# EAGLE design ubus_rev_b (EAGLE 6.4)
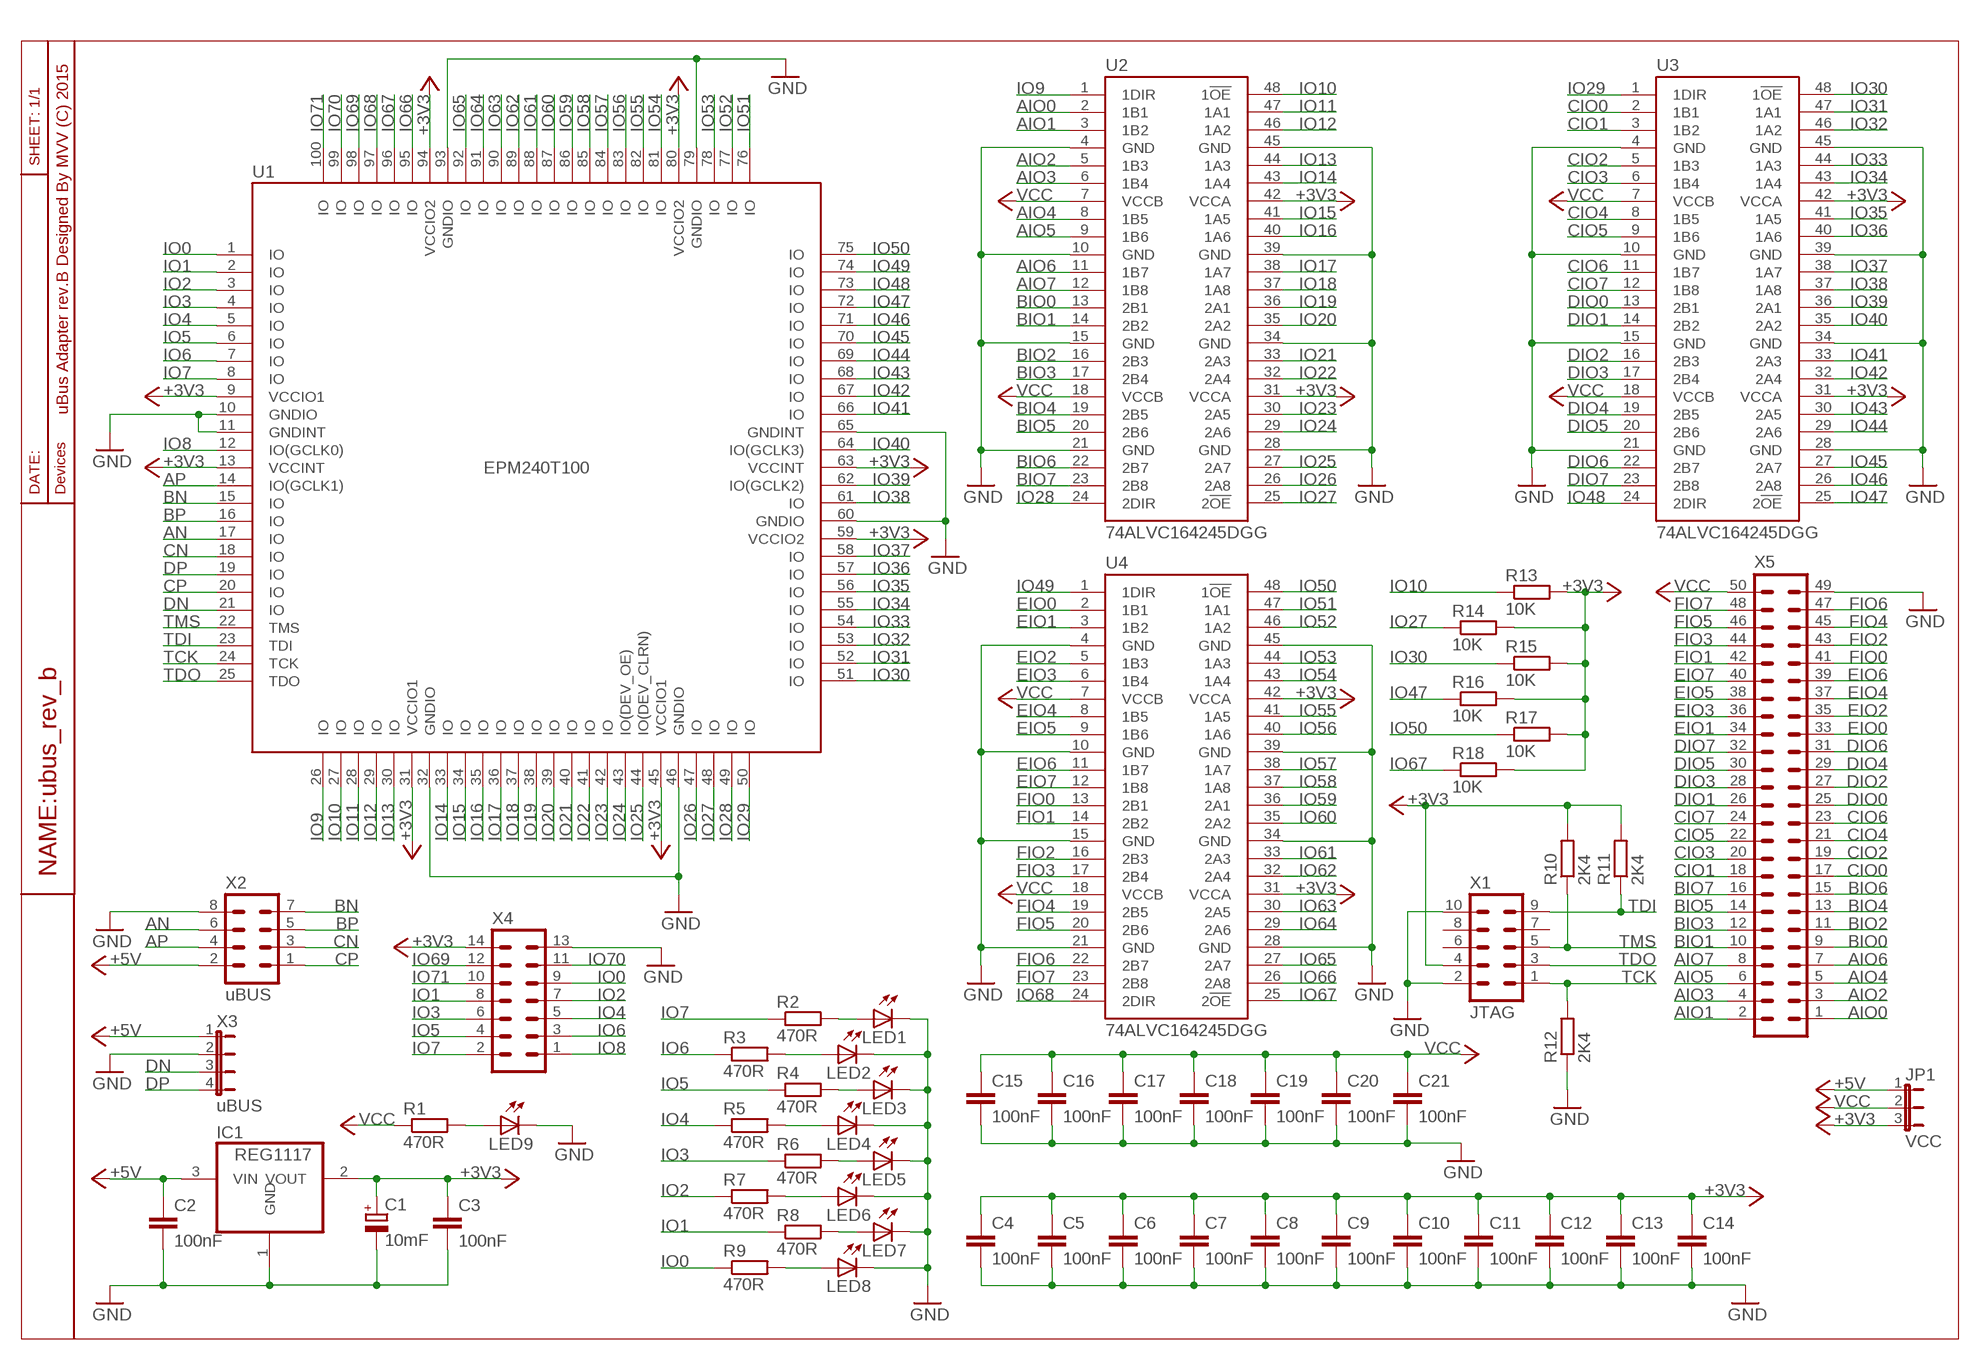
[diagram p0: schematic, sheet 1]

## Parts
C1  10mF  CPOL-EUCT6032  [CT6032]
C2  100nF  C-EUC0805  [C0805]
C3  100nF  C-EUC0805  [C0805]
C4  100nF  C-EUC0805  [C0805]
C5  100nF  C-EUC0805  [C0805]
C6  100nF  C-EUC0805  [C0805]
C7  100nF  C-EUC0805  [C0805]
C8  100nF  C-EUC0805  [C0805]
C9  100nF  C-EUC0805  [C0805]
C10  100nF  C-EUC0805  [C0805]
C11  100nF  C-EUC0805  [C0805]
C12  100nF  C-EUC0805  [C0805]
C13  100nF  C-EUC0805  [C0805]
C14  100nF  C-EUC0805  [C0805]
C15  100nF  C-EUC0805  [C0805]
C16  100nF  C-EUC0805  [C0805]
C17  100nF  C-EUC0805  [C0805]
C18  100nF  C-EUC0805  [C0805]
C19  100nF  C-EUC0805  [C0805]
C20  100nF  C-EUC0805  [C0805]
C21  100nF  C-EUC0805  [C0805]
IC1  REG1117  [SOT223]
JP1  VCC  JP2E  [JP2]
LED1  LEDCHIPLED_0805  [CHIPLED_0805]
LED2  LEDCHIPLED_0805  [CHIPLED_0805]
LED3  LEDCHIPLED_0805  [CHIPLED_0805]
LED4  LEDCHIPLED_0805  [CHIPLED_0805]
LED5  LEDCHIPLED_0805  [CHIPLED_0805]
LED6  LEDCHIPLED_0805  [CHIPLED_0805]
LED7  LEDCHIPLED_0805  [CHIPLED_0805]
LED8  LEDCHIPLED_0805  [CHIPLED_0805]
LED9  LEDCHIPLED_0805  [CHIPLED_0805]
R1  470R  R-EU_R0805  [R0805]
R2  470R  R-EU_R0805  [R0805]
R3  470R  R-EU_R0805  [R0805]
R4  470R  R-EU_R0805  [R0805]
R5  470R  R-EU_R0805  [R0805]
R6  470R  R-EU_R0805  [R0805]
R7  470R  R-EU_R0805  [R0805]
R8  470R  R-EU_R0805  [R0805]
R9  470R  R-EU_R0805  [R0805]
R10  2K4  R-EU_R0805  [R0805]
R11  2K4  R-EU_R0805  [R0805]
R12  2K4  R-EU_R0805  [R0805]
R13  10K  R-EU_R0805  [R0805]
R14  10K  R-EU_R0805  [R0805]
R15  10K  R-EU_R0805  [R0805]
R16  10K  R-EU_R0805  [R0805]
R17  10K  R-EU_R0805  [R0805]
R18  10K  R-EU_R0805  [R0805]
U1  EPM240T100  [TQFP100]
U2  74ALVC164245DGG  [TSSOP48DGG]
U3  74ALVC164245DGG  [TSSOP48DGG]
U4  74ALVC164245DGG  [TSSOP48DGG]
X1  JTAG  ML10  [ML10]
X2  uBUS  MA04-2  [MA04-2]
X3  uBUS  JP4E  [JP4]
X4  ML14  [ML14]
X5  ML50  [ML50]

## Nets
+3V3: C1.+ C3.1 C4.1 C5.1 C6.1 C7.1 C8.1 C9.1 C10.1 C11.1 C12.1 C13.1 C14.1 IC1.2(VOUT) JP1.3 R10.2 R11.2 R13.2 R14.2 R15.2 R16.2 R17.2 R18.2 U1.9(VCCIO1) U1.13(VCCINT) U1.31(VCCIO1) U1.45(VCCIO1) U1.59(VCCIO2) U1.63(VCCINT) U1.80(VCCIO2) U1.94(VCCIO2) U2.31(VCCA) U2.42(VCCA) U3.31(VCCA) U3.42(VCCA) U4.31(VCCA) U4.42(VCCA) X1.4 X4.14
+5V: C2.1 IC1.3(VIN) JP1.1 X2.2 X3.1
AIO0: U2.2(1B1) X5.1
AIO1: U2.3(1B2) X5.2
AIO2: U2.5(1B3) X5.3
AIO3: U2.6(1B4) X5.4
AIO4: U2.8(1B5) X5.5
AIO5: U2.9(1B6) X5.6
AIO6: U2.11(1B7) X5.7
AIO7: U2.12(1B8) X5.8
AN: U1.17(IO) X2.6
AP: U1.14(IO(GCLK1)) X2.4
BIO0: U2.13(2B1) X5.9
BIO1: U2.14(2B2) X5.10
BIO2: U2.16(2B3) X5.11
BIO3: U2.17(2B4) X5.12
BIO4: U2.19(2B5) X5.13
BIO5: U2.20(2B6) X5.14
BIO6: U2.22(2B7) X5.15
BIO7: U2.23(2B8) X5.16
BN: U1.15(IO) X2.7
BP: U1.16(IO) X2.5
CIO0: U3.2(1B1) X5.17
CIO1: U3.3(1B2) X5.18
CIO2: U3.5(1B3) X5.19
CIO3: U3.6(1B4) X5.20
CIO4: U3.8(1B5) X5.21
CIO5: U3.9(1B6) X5.22
CIO6: U3.11(1B7) X5.23
CIO7: U3.12(1B8) X5.24
CN: U1.18(IO) X2.3
CP: U1.20(IO) X2.1
DIO0: U3.13(2B1) X5.25
DIO1: U3.14(2B2) X5.26
DIO2: U3.16(2B3) X5.27
DIO3: U3.17(2B4) X5.28
DIO4: U3.19(2B5) X5.29
DIO5: U3.20(2B6) X5.30
DIO6: U3.22(2B7) X5.31
DIO7: U3.23(2B8) X5.32
DN: U1.21(IO) X3.3
DP: U1.19(IO) X3.4
EIO0: U4.2(1B1) X5.33
EIO1: U4.3(1B2) X5.34
EIO2: U4.5(1B3) X5.35
EIO3: U4.6(1B4) X5.36
EIO4: U4.8(1B5) X5.37
EIO5: U4.9(1B6) X5.38
EIO6: U4.11(1B7) X5.39
EIO7: U4.12(1B8) X5.40
FIO0: U4.13(2B1) X5.41
FIO1: U4.14(2B2) X5.42
FIO2: U4.16(2B3) X5.43
FIO3: U4.17(2B4) X5.44
FIO4: U4.19(2B5) X5.45
FIO5: U4.20(2B6) X5.46
FIO6: U4.22(2B7) X5.47
FIO7: U4.23(2B8) X5.48
GND: C1.- C2.2 C3.2 C4.2 C5.2 C6.2 C7.2 C8.2 C9.2 C10.2 C11.2 C12.2 C13.2 C14.2 C15.2 C16.2 C17.2 C18.2 C19.2 C20.2 C21.2 IC1.1(GND) LED1.C LED2.C LED3.C LED4.C LED5.C LED6.C LED7.C LED8.C LED9.C R12.1 U1.10(GNDIO) U1.11(GNDINT) U1.32(GNDIO) U1.46(GNDIO) U1.60(GNDIO) U1.65(GNDINT) U1.79(GNDIO) U1.93(GNDIO) U2.4(GND) U2.10(GND) U2.15(GND) U2.21(GND) U2.28(GND) U2.34(GND) U2.39(GND) U2.45(GND) U3.4(GND) U3.10(GND) U3.15(GND) U3.21(GND) U3.28(GND) U3.34(GND) U3.39(GND) U3.45(GND) U4.4(GND) U4.10(GND) U4.15(GND) U4.21(GND) U4.28(GND) U4.34(GND) U4.39(GND) U4.45(GND) X1.2 X1.10 X2.8 X3.2 X4.13 X5.49
IO0: R9.1 U1.1(IO) X4.9
IO1: R8.1 U1.2(IO) X4.8
IO2: R7.1 U1.3(IO) X4.7
IO3: R6.1 U1.4(IO) X4.6
IO4: R5.1 U1.5(IO) X4.5
IO5: R4.1 U1.6(IO) X4.4
IO6: R3.1 U1.7(IO) X4.3
IO7: R2.1 U1.8(IO) X4.2
IO8: U1.12(IO(GCLK0)) X4.1
IO9: U1.26(IO) U2.1(1DIR)
IO10: R13.1 U1.27(IO) U2.48(1!OE)
IO11: U1.28(IO) U2.47(1A1)
IO12: U1.29(IO) U2.46(1A2)
IO13: U1.30(IO) U2.44(1A3)
IO14: U1.33(IO) U2.43(1A4)
IO15: U1.34(IO) U2.41(1A5)
IO16: U1.35(IO) U2.40(1A6)
IO17: U1.36(IO) U2.38(1A7)
IO18: U1.37(IO) U2.37(1A8)
IO19: U1.38(IO) U2.36(2A1)
IO20: U1.39(IO) U2.35(2A2)
IO21: U1.40(IO) U2.33(2A3)
IO22: U1.41(IO) U2.32(2A4)
IO23: U1.42(IO) U2.30(2A5)
IO24: U1.43(IO(DEV_OE)) U2.29(2A6)
IO25: U1.44(IO(DEV_CLRN)) U2.27(2A7)
IO26: U1.47(IO) U2.26(2A8)
IO27: R14.1 U1.48(IO) U2.25(2!OE)
IO28: U1.49(IO) U2.24(2DIR)
IO29: U1.50(IO) U3.1(1DIR)
IO30: R15.1 U1.51(IO) U3.48(1!OE)
IO31: U1.52(IO) U3.47(1A1)
IO32: U1.53(IO) U3.46(1A2)
IO33: U1.54(IO) U3.44(1A3)
IO34: U1.55(IO) U3.43(1A4)
IO35: U1.56(IO) U3.41(1A5)
IO36: U1.57(IO) U3.40(1A6)
IO37: U1.58(IO) U3.38(1A7)
IO38: U1.61(IO) U3.37(1A8)
IO39: U1.62(IO(GCLK2)) U3.36(2A1)
IO40: U1.64(IO(GCLK3)) U3.35(2A2)
IO41: U1.66(IO) U3.33(2A3)
IO42: U1.67(IO) U3.32(2A4)
IO43: U1.68(IO) U3.30(2A5)
IO44: U1.69(IO) U3.29(2A6)
IO45: U1.70(IO) U3.27(2A7)
IO46: U1.71(IO) U3.26(2A8)
IO47: R16.1 U1.72(IO) U3.25(2!OE)
IO48: U1.73(IO) U3.24(2DIR)
IO49: U1.74(IO) U4.1(1DIR)
IO50: R17.1 U1.75(IO) U4.48(1!OE)
IO51: U1.76(IO) U4.47(1A1)
IO52: U1.77(IO) U4.46(1A2)
IO53: U1.78(IO) U4.44(1A3)
IO54: U1.81(IO) U4.43(1A4)
IO55: U1.82(IO) U4.41(1A5)
IO56: U1.83(IO) U4.40(1A6)
IO57: U1.84(IO) U4.38(1A7)
IO58: U1.85(IO) U4.37(1A8)
IO59: U1.86(IO) U4.36(2A1)
IO60: U1.87(IO) U4.35(2A2)
IO61: U1.88(IO) U4.33(2A3)
IO62: U1.89(IO) U4.32(2A4)
IO63: U1.90(IO) U4.30(2A5)
IO64: U1.91(IO) U4.29(2A6)
IO65: U1.92(IO) U4.27(2A7)
IO66: U1.95(IO) U4.26(2A8)
IO67: R18.1 U1.96(IO) U4.25(2!OE)
IO68: U1.97(IO) U4.24(2DIR)
IO69: U1.98(IO) X4.12
IO70: U1.99(IO) X4.11
IO71: U1.100(IO) X4.10
N$1: LED1.A R2.2
N$2: LED2.A R3.2
N$3: LED3.A R4.2
N$4: LED4.A R5.2
N$5: LED5.A R6.2
N$6: LED6.A R7.2
N$7: LED7.A R8.2
N$8: LED8.A R9.2
N$12: LED9.A R1.2
TCK: R12.2 U1.24(TCK) X1.1
TDI: R11.1 U1.23(TDI) X1.9
TDO: U1.25(TDO) X1.3
TMS: R10.1 U1.22(TMS) X1.5
VCC: C15.1 C16.1 C17.1 C18.1 C19.1 C20.1 C21.1 JP1.2 R1.1 U2.7(VCCB) U2.18(VCCB) U3.7(VCCB) U3.18(VCCB) U4.7(VCCB) U4.18(VCCB) X5.50
Unconnected: X1.6 X1.7 X1.8

## Notes on the sheet
- uBus Adapter rev.B Designed By MVV (C) 2015

## Library data of the parts
C1 = rcl:CPOL-EU: POLARIZED CAPACITOR, European symbol
C2-C21 = rcl:C-EU: CAPACITOR, European symbol
IC1 = burr-brown:REG1117: 800mA and 1A Low Dropout (LDO) Positive Regulator 1.8V, 2.5V, 2.85V, 3.3V, 5V, and Adj; MPN: REG1117; OC_FARNELL: 1097566; OC_NEWARK: 14P6981
JP1 = jumper:JP2E: JUMPER
LED1-LED9 = led:LED: LED OSRAM: - CHIPLED LG R971, LG N971, LY N971, LG Q971, LY Q971, LO R971, LY R971 LH N974, LH R974 LS Q976, LO Q976, LY Q976 LO Q996 - Hyper CHIPLED LW Q18S LB Q993, LB Q99A, LB R99A - SideLED LS A670, LO A670, LY A670, LG A670, LP A670 LB A673, LV A673, LT A673, LW A673 LH A674 LY A675 LS A676, LA A676, LO A676, LY A676, LW A676 LS A679, LY A679, LG A679 - Hyper Micro SIDELED® LS Y876, LA Y876, LO Y876, LY Y876 LT Y87S - SmartLED LW L88C, LW L88S LB L89C, LB L89S, LG L890 LS L89K, LO L89K, LY L89K LS L896, LA L896, LO L896, LY L896 - TOPLED LS T670, LO T670, LY T670, LG T670, LP T670 LSG T670, LSP T670, LSY T670, LOP T670, LYG T670 LG T671, LOG T671, LSG T671 LB T673, LV T673, LT T673, LW T673 LH T674 LS T676, LA T676, LO T676, LY T676, LB T676, LH T676, LSB T676, LW T676 LB T67C, LV T67C, LT T67C, LS T67K, LO T67K, LY T67K, LW E67C LS E67B, LA E67B, LO E67B, LY E67B, LB E67C, LV E67C, LT E67C LW T67C LS T679, LY T679, LG T679 LS T770, LO T770, LY T770, LG T770, LP T770 LB T773, LV T773, LT T773, LW T773 LH T774 LS E675, LA E675, LY E675, LS T675 LS T776, LA T776, LO T776, LY T776, LB T776 LHGB T686 LT T68C, LB T68C - Hyper Mini TOPLED® LB M676 - Mini TOPLED Santana® LG M470 LS M47K, LO M47K, LY M47K Source: http://www.osram.convergy.de LUXEON: - LUMILED® LXK2-PW12-R00, LXK2-PW12-S00, LXK2-PW14-U00, LXK2-PW14-V00 LXK2-PM12-R00, LXK2-PM12-S00, LXK2-PM14-U00 LXK2-PE12-Q00, LXK2-PE12-R00, LXK2-PE12-S00, LXK2-PE14-T00, LXK2-PE14-U00 LXK2-PB12-K00, LXK2-PB12-L00, LXK2-PB12-M00, LXK2-PB14-N00, LXK2-PB14-P00, LXK2-PB14-Q00 LXK2-PR12-L00, LXK2-PR12-M00, LXK2-PR14-Q00, LXK2-PR14-R00 LXK2-PD12-Q00, LXK2-PD12-R00, LXK2-PD12-S00 LXK2-PH12-R00, LXK2-PH12-S00 LXK2-PL12-P00, LXK2-PL12-Q00, LXK2-PL12-R00 Source: www.luxeon.com KINGBRIGHT: KA-3528ASYC Source: www.kingbright.com
R1-R18 = rcl:R-EU_: RESISTOR, European symbol
U1 = altera:EPM240T100
U2-U4 = _74ac-logic:74ALVC164245
X1 = con-ml:ML10: HARTING
X2 = con-lstb:MA04-2: PIN HEADER; OC_FARNELL: unknown; OC_NEWARK: unknown
X3 = jumper:JP4E: JUMPER
X4 = con-ml:ML14: HARTING
X5 = con-ml:ML50: HARTING

## Board
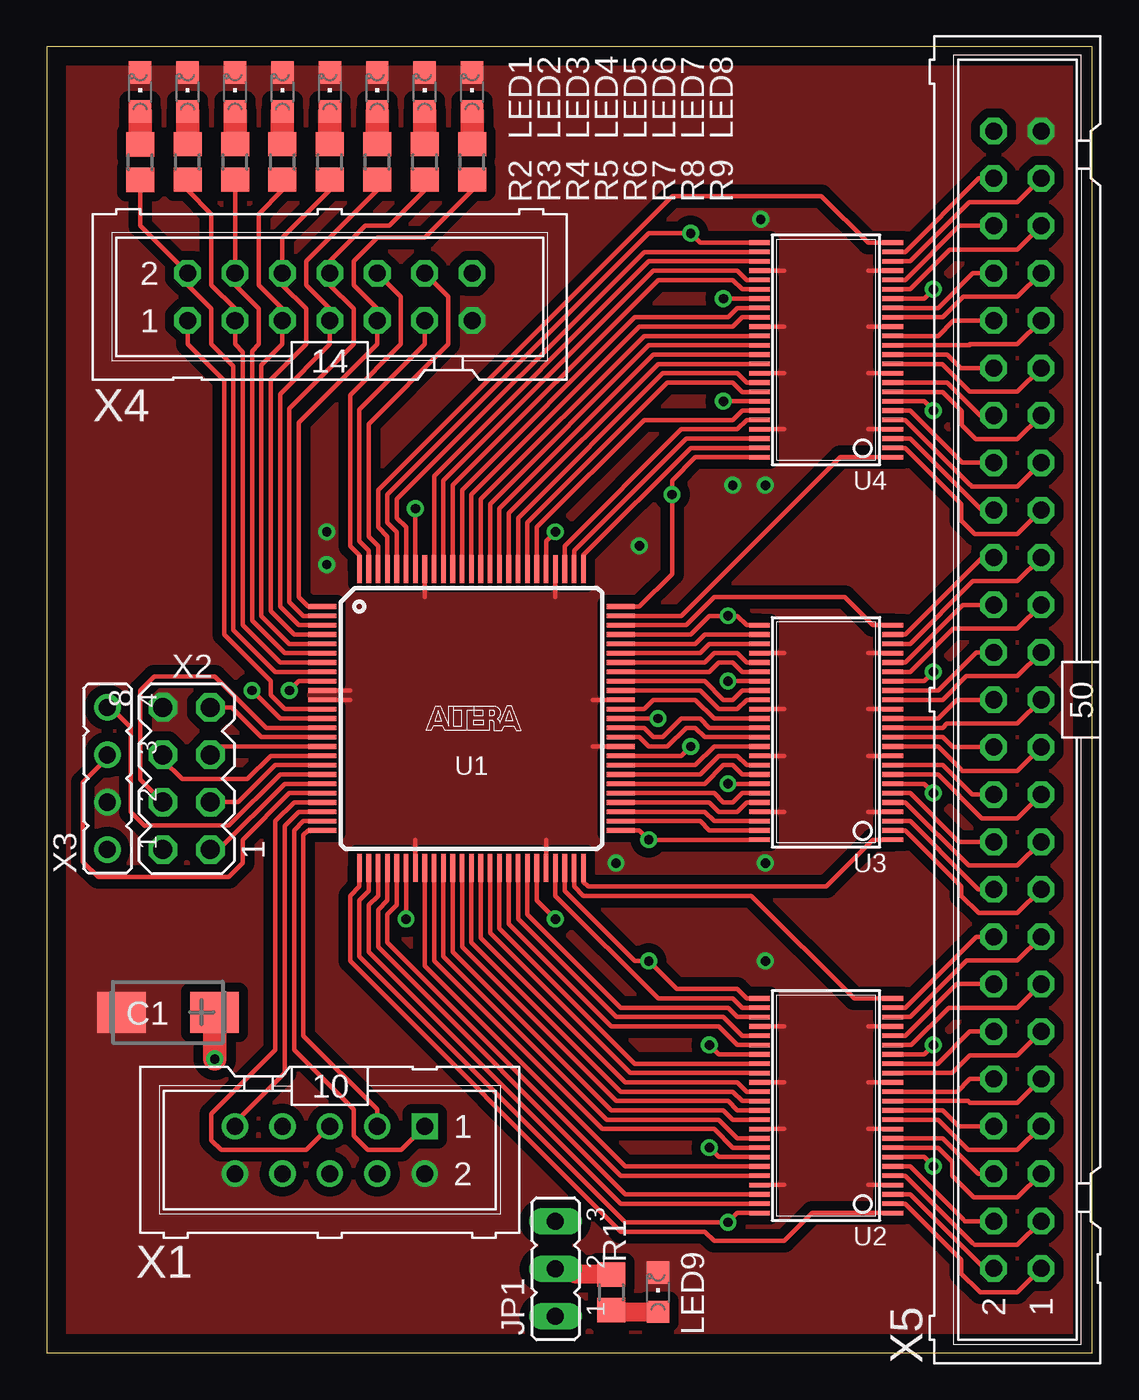
[diagram p1: board, top side]
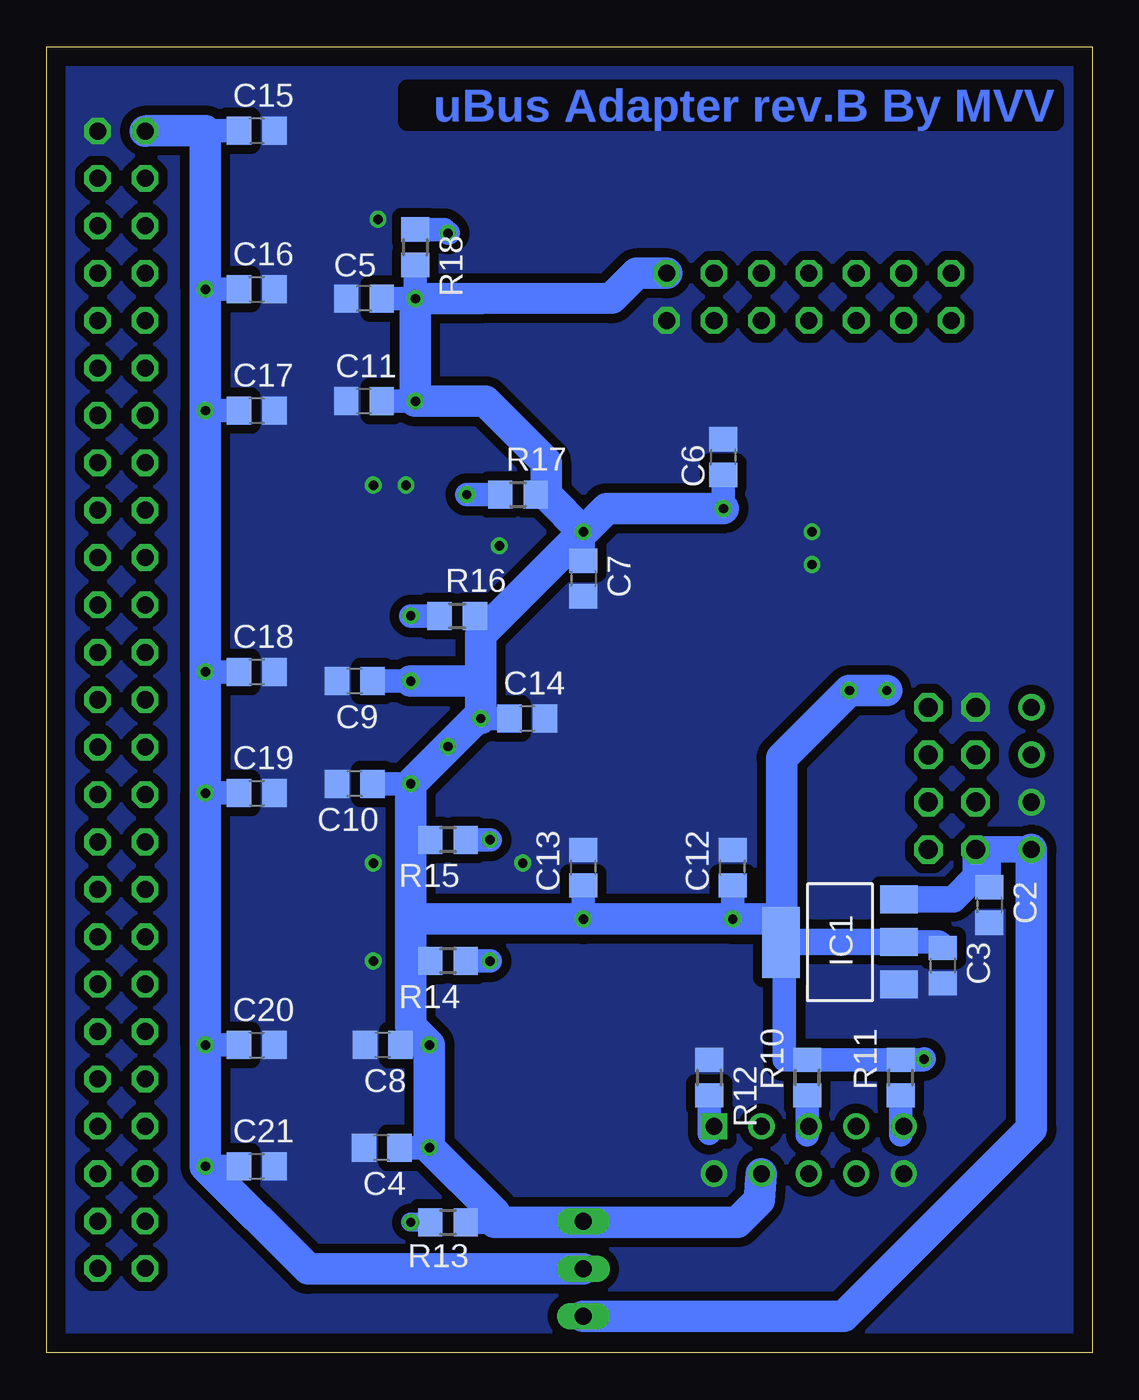
[diagram p2: board, bottom side, seen from below]

Size 56 x 70 mm. Coordinates in mm from the lower left corner, seen from the top.
Outline: 0,0 56,0 56,70 0,70 0,0
Copper layers (1*16): Top 0.035mm / dielectric 1.5mm / Bottom 0.035mm
Design rules "default": minimum track width 10mil, minimum drill 24mil, track to track 8mil, track to pad 8mil, pad to pad 8mil, via to via 8mil, smd to smd 8mil, copper to edge 40mil, drill to drill 8mil, minimum pad ring 10mil, minimum via ring 8mil, stop-mask expansion 4mil, vias tented up to drill 0mil, thermal gap 10mil

### Footprints (pad centres in the part's own frame; a part is rotated, then mirrored left to right if it is on the bottom)
CT6032 = smd 2.6 x 2.2: + -2.5,0; - 2.5,0
C0805 = smd 1.3 x 1.5: 1 -0.95,0; 2 0.95,0
SOT223 = smd 1.499 x 2.007: 1 -2.261,-3.15; 2 0.025,-3.15; 3 2.311,-3.15 | smd 3.81 x 2.007: 4 0,3.15
JP2 = drill 0.914 long: 1 -2.54,0; 2 0,0; 3 2.54,0
CHIPLED_0805 = smd 1.2 x 1.2: A 0,-1.05; C 0,1.05
R0805 = smd 1.3 x 1.5: 1 -0.95,0; 2 0.95,0
TQFP100 = smd 1.5 x 0.25: 1 -8,6; 2 -8,5.5; 3 -8,5; 4 -8,4.5; 5 -8,4; 6 -8,3.5; 7 -8,3; 8 -8,2.5; 9 -8,2; 10 -8,1.5; 11 -8,1; 12 -8,0.5; 13 -8,0; 14 -8,-0.5; 15 -8,-1; 16 -8,-1.5; 17 -8,-2; 18 -8,-2.5; 19 -8,-3; 20 -8,-3.5; 21 -8,-4; 22 -8,-4.5; 23 -8,-5; 24 -8,-5.5; 25 -8,-6; 51 8,-6; 52 8,-5.5; 53 8,-5; 54 8,-4.5; 55 8,-4; 56 8,-3.5; 57 8,-3; 58 8,-2.5; 59 8,-2; 60 8,-1.5; 61 8,-1; 62 8,-0.5; 63 8,0; 64 8,0.5; 65 8,1; 66 8,1.5; 67 8,2; 68 8,2.5; 69 8,3; 70 8,3.5; 71 8,4; 72 8,4.5; 73 8,5; 74 8,5.5; 75 8,6 | smd 0.25 x 1.5: 26 -6,-8; 27 -5.5,-8; 28 -5,-8; 29 -4.5,-8; 30 -4,-8; 31 -3.5,-8; 32 -3,-8; 33 -2.5,-8; 34 -2,-8; 35 -1.5,-8; 36 -1,-8; 37 -0.5,-8; 38 0,-8; 39 0.5,-8; 40 1,-8; 41 1.5,-8; 42 2,-8; 43 2.5,-8; 44 3,-8; 45 3.5,-8; 46 4,-8; 47 4.5,-8; 48 5,-8; 49 5.5,-8; 50 6,-8; 76 6,8; 77 5.5,8; 78 5,8; 79 4.5,8; 80 4,8; 81 3.5,8; 82 3,8; 83 2.5,8; 84 2,8; 85 1.5,8; 86 1,8; 87 0.5,8; 88 0,8; 89 -0.5,8; 90 -1,8; 91 -1.5,8; 92 -2,8; 93 -2.5,8; 94 -3,8; 95 -3.5,8; 96 -4,8; 97 -4.5,8; 98 -5,8; 99 -5.5,8; 100 -6,8
TSSOP48DGG = smd 0.25 x 1.1: 1 -5.5,-3.575; 2 -5,-3.575; 3 -4.5,-3.575; 4 -4,-3.575; 5 -3.5,-3.575; 6 -3,-3.575; 7 -2.5,-3.575; 8 -2,-3.575; 9 -1.5,-3.575; 10 -1,-3.575; 11 -0.5,-3.575; 12 0,-3.575; 13 0.5,-3.575; 14 1,-3.575; 15 1.5,-3.575; 16 2,-3.575; 17 2.5,-3.575; 18 3,-3.575; 19 3.5,-3.575; 20 4,-3.575; 21 4.5,-3.575; 22 5,-3.575; 23 5.5,-3.575; 24 6,-3.575; 25 6,3.575; 26 5.5,3.575; 27 5,3.575; 28 4.5,3.575; 29 4,3.575; 30 3.5,3.575; 31 3,3.575; 32 2.5,3.575; 33 2,3.575; 34 1.5,3.575; 35 1,3.575; 36 0.5,3.575; 37 0,3.575; 38 -0.5,3.575; 39 -1,3.575; 40 -1.5,3.575; 41 -2,3.575; 42 -2.5,3.575; 43 -3,3.575; 44 -3.5,3.575; 45 -4,3.575; 46 -4.5,3.575; 47 -5,3.575; 48 -5.5,3.575
ML10 = drill 0.9 square: 1 -5.08,-1.27 | drill 0.9: 2 -5.08,1.27; 3 -2.54,-1.27; 4 -2.54,1.27; 5 0,-1.27; 6 0,1.27; 7 2.54,-1.27; 8 2.54,1.27; 9 5.08,-1.27; 10 5.08,1.27
MA04-2 = drill 1.016 octagon: 1 -3.81,-1.27; 2 -3.81,1.27; 3 -1.27,-1.27; 4 -1.27,1.27; 5 1.27,-1.27; 6 1.27,1.27; 7 3.81,-1.27; 8 3.81,1.27
JP4 = drill 0.914: 1 -3.81,0; 2 -1.27,0; 3 1.27,0; 4 3.81,0
ML14 = drill 0.914 octagon: 1 -7.62,-1.27; 2 -7.62,1.27; 3 -5.08,-1.27; 4 -5.08,1.27; 5 -2.54,-1.27; 6 -2.54,1.27; 7 0,-1.27; 8 0,1.27; 9 2.54,-1.27; 10 2.54,1.27; 11 5.08,-1.27; 12 5.08,1.27; 13 7.62,-1.27; 14 7.62,1.27
ML50 = drill 0.914 octagon: 1 -30.48,-1.27; 2 -30.48,1.27; 3 -27.94,-1.27; 4 -27.94,1.27; 5 -25.4,-1.27; 6 -25.4,1.27; 7 -22.86,-1.27; 8 -22.86,1.27; 9 -20.32,-1.27; 10 -20.32,1.27; 11 -17.78,-1.27; 12 -17.78,1.27; 13 -15.24,-1.27; 14 -15.24,1.27; 15 -12.7,-1.27; 16 -12.7,1.27; 17 -10.16,-1.27; 18 -10.16,1.27; 19 -7.62,-1.27; 20 -7.62,1.27; 21 -5.08,-1.27; 22 -5.08,1.27; 23 -2.54,-1.27; 24 -2.54,1.27; 25 0,-1.27; 26 0,1.27; 27 2.54,-1.27; 28 2.54,1.27; 29 5.08,-1.27; 30 5.08,1.27; 31 7.62,-1.27; 32 7.62,1.27; 33 10.16,-1.27; 34 10.16,1.27; 35 12.7,-1.27; 36 12.7,1.27; 37 15.24,-1.27; 38 15.24,1.27; 39 17.78,-1.27; 40 17.78,1.27; 41 20.32,-1.27; 42 20.32,1.27; 43 22.86,-1.27; 44 22.86,1.27; 45 25.4,-1.27; 46 25.4,1.27; 47 27.94,-1.27; 48 27.94,1.27; 49 30.48,-1.27; 50 30.48,1.27

### Placement (x,y rotation side)
C1  6.5,18.25 180 top
C2  5.5,24 270 bottom
C3  8,20.75 270 bottom
C4  38.05,10.99 180 bottom
C5  39,56.5 180 bottom
C6  19.75,48 90 bottom
C7  27.25,41.5 270 bottom
C8  38,16.5 180 bottom
C9  39.5,36 180 bottom
C10  39.5,30.5 180 bottom
C11  39,51 180 bottom
C12  19.25,26 90 bottom
C13  27.25,26 90 bottom
C14  30.25,34 0 bottom
C15  44.75,65.5 0 bottom
C16  44.75,57 0 bottom
C17  44.75,50.5 0 bottom
C18  44.75,36.5 0 bottom
C19  44.75,30 0 bottom
C20  44.75,16.5 0 bottom
C21  44.75,10 0 bottom
IC1  13.5,22 90 bottom
JP1  27.25,4.5 90 top
LED1  5.01,67.57 0 top
LED2  7.55,67.57 0 top
LED3  10.09,67.57 0 top
LED4  12.63,67.57 0 top
LED5  15.17,67.57 0 top
LED6  17.71,67.57 0 top
LED7  20.25,67.57 0 top
LED8  22.79,67.57 0 top
LED9  32.75,3.25 0 top
R1  30.25,3.25 270 top
R2  5.01,63.8 90 top
R3  7.55,63.82 90 top
R4  10.09,63.82 90 top
R5  12.63,63.82 90 top
R6  15.17,63.82 90 top
R7  17.71,63.82 90 top
R8  20.25,63.82 90 top
R9  22.79,63.82 90 top
R10  15.25,14.75 90 bottom
R11  10.25,14.75 90 bottom
R12  20.5,14.75 270 bottom
R13  34.5,7 0 bottom
R14  34.5,21 180 bottom
R15  34.5,27.5 180 bottom
R16  34,39.5 0 bottom
R17  30.75,46 0 bottom
R18  36.25,59.25 270 bottom
U1  22.75,34 0 top
U2  41.75,13 90 top
U3  41.75,33 90 top
U4  41.75,53.5 90 top
X1  15.17,10.87 180 top
X2  7.5,30.78 90 top
X3  3.25,30.78 90 top
X4  15.17,56.59 0 top
X5  52,35 90 top

### Tracks (layer width: path | path; a pad name or v marks a point on that pad's centre or on a via)
+3V3  (via drill 0.5)
  Top 0.25: U4.31 v36.25,56.5 | U1.80 26.75,43.5 v27.25,44 | U1.94 v19.75,45.25 | U3.42 v36.5,30.5 | U1.63 v32.75,34 | U3.31 v36.5,36 | U1.31 v19.25,23.25 | U1.45 26.25,24.25 v27.25,23.25 | U1.59 34,32 v34.5,32.5 | U4.42 v36.25,51 | U1.13 12.5,34 v11,35.5 | U1.9 13.5,36 v13,35.5
  Top 0.254: U2.31 36,16 v35.5,16.5 | U2.42 36,10.5 v35.5,11
  Top 1.27: C1.+ v9,15.75
  Bottom 1.27: C6.1 v19.75,45.25 | C8.1 v35.5,16.5 | C4.1 v35.51,10.99 v35.5,11 | C14.1 v32.75,34 | C10.1 v36.5,30.5 | C12.1 v19.25,23.25 | C13.1 v27.25,23.25 | R13.2 32,7 | R18.2 v36.25,56.5 C5.1 | IC1.2 8.33,22.02 arc90 C3.1 | JP1.3 27.5,7 | R14.2 36.5,21 | R15.2 36.5,27.5 | 16.5,22 16.5,15.7 R10.2 R11.2 9.05,15.7 v9,15.75 | v36.5,36 C9.1 | R16.2 31.75,39.5 | C11.1 v36.25,51 | C7.1 v27.25,44 | R17.2 29.25,46
  Bottom 1.422: IC1.2 16.5,22.02 16.5,22
  Bottom 1.676: X1.4 17.83,8.17 19,7 27.5,7 32,7 32,7.5 v35.5,11 v35.5,16.5 36.5,17.5 36.5,21 36.5,23.25 | 36.5,23.25 36.5,27.5 v36.5,30.5 v34.5,32.5 33,34 v32.75,34 32.75,36.25 | 36.5,23.25 v27.25,23.25 v19.25,23.25 17.12,23.25 16.62,22.75 | 16.5,22 16.62,22.12 16.62,22.75 | 16.62,22.75 16.62,31.88 v13,35.5 v11,35.5 | 32.75,36.25 32.75,38.5 31.75,39.5 v27.25,44 | v36.5,36 33,36 arc-90 32.75,36.25 | v19.75,45.25 26,45.25 v27.25,44 | v27.25,44 29.25,46 29.25,47.75 32.5,51 v36.25,51 v36.25,56.5 32.75,56.5 25.73,56.52 24.39,57.86 X4.14
+5V
  Bottom 1.27: 10.41,24.25 IC1.3 | C2.1 5.5,26.97
  Bottom 1.422: X3.1 5.5,26.97 X2.2 6.23,25.52 7.44,24.31 IC1.3
  Bottom 1.676: JP1.1 13.29,1.96 3.25,12 X3.1
AIO0
  Top 0.25: U2.2 46,8 49,5 49,4.25 49.91,3.34
  Top 0.254: X5.1 52,3.25 50,3.25 49.91,3.34
AIO1
  Top 0.25: U2.3 46.25,8.5 50.14,4.61
  Top 0.254: 50.14,4.61 50.23,4.52 X5.2
AIO2
  Top 0.25: U2.5 46,9.5 49.62,5.88
  Top 0.254: X5.3 52,5.79 49.71,5.79 49.62,5.88
AIO3
  Top 0.25: U2.6 46.25,10 49.1,7.15
  Top 0.254: X5.4 49.19,7.06 49.1,7.15
AIO4
  Top 0.25: U2.8 47.75,11 48.5,10.25 48.5,9.5 49.58,8.42
  Top 0.254: X5.5 52,8.33 49.67,8.33 49.58,8.42
AIO5
  Top 0.25: U2.9 48,11.5
  Top 0.254: X5.6 49.9,9.6 48,11.5
AIO6
  Top 0.25: U2.11 47.75,12.5 49.29,10.96
  Top 0.254: X5.7 52,10.87 49.38,10.87 49.29,10.96
AIO7
  Top 0.25: U2.12 48,13 48.77,12.23
  Top 0.254: X5.8 48.86,12.14 48.77,12.23
AN
  Top 0.25: U1.17 12,32 10.75,30.75 7.26,30.75 6.23,31.78 X2.6
AP
  Top 0.25: U1.14 11.75,33.5 9,36.25 5.75,36.25 5,35.5 5,30.74 X2.4
BIO0
  Top 0.254: X5.9 52,13.41 49.46,13.41 49.37,13.5 U2.13
BIO1
  Top 0.25: U2.14 47.89,14
  Top 0.254: X5.10 49.46,14.68 48.78,14 47.89,14
BIO2
  Top 0.25: U2.16 48.12,15
  Top 0.254: X5.11 52,15.95 49.46,15.95 48.51,15 48.12,15
BIO3
  Top 0.25: U2.17 47.35,15.5
  Top 0.254: X5.12 49.46,17.22 47.74,15.5 47.35,15.5
BIO4
  Top 0.25: U2.19 46.33,16.5
  Top 0.254: X5.13 52,18.49 48.32,18.49 46.33,16.5
BIO5
  Top 0.25: U2.20 46,17
  Top 0.254: X5.14 48.76,19.76 46,17
BIO6
  Top 0.25: U2.22 46.25,18
  Top 0.254: X5.15 52,21.03 49.28,21.03 46.25,18
BIO7
  Top 0.25: U2.23 46,18.5
  Top 0.254: X5.16 49.8,22.3 46,18.5
BN
  Top 0.25: X2.7 9.91,34.59 11.5,33 U1.15
BP
  Top 0.25: X2.5 8.82,32 9,32.25 9.25,32.5 U1.16
CIO0
  Top 0.25: U3.2 46,28 49,25 49,24.5
  Top 0.254: X5.17 52,23.57 49.93,23.57 49,24.5
CIO1
  Top 0.25: U3.3 46.25,28.5
  Top 0.254: X5.18 49.96,24.84 49.91,24.84 49.75,25 49.46,25.29 46.25,28.5
CIO2
  Top 0.25: U3.5 46,29.5
  Top 0.254: X5.19 52,26.11 49.39,26.11 46,29.5
CIO3
  Top 0.25: U3.6 46.25,30 48.78,27.47
  Top 0.254: X5.20 48.87,27.38 48.78,27.47
CIO4
  Top 0.25: U3.8 47.75,31
  Top 0.254: X5.21 52,28.65 50.1,28.65 47.75,31
CIO5
  Top 0.25: U3.9 48,31.5
  Top 0.254: X5.22 49.58,29.92 48,31.5
CIO6
  Top 0.25: U3.11 47.75,32.5 48.97,31.28
  Top 0.254: X5.23 52,31.19 49.06,31.19 48.97,31.28
CIO7
  Top 0.25: U3.12 48,33 48.45,32.55
  Top 0.254: 48.45,32.55 48.54,32.46 X5.24
CN
  Top 0.25: X2.3 10.26,29.51 12.25,31.5 U1.18
CP
  Top 0.25: X2.1 9.22,26.97 12.75,30.5 U1.20
DIO0
  Top 0.25: U3.13 48,33.5
  Top 0.254: X5.25 52,33.73 48.23,33.73 48,33.5
DIO1
  Top 0.25: U3.14 47.75,34
  Top 0.254: X5.26 48.75,35 47.75,34
DIO2
  Top 0.25: U3.16 48,35
  Top 0.254: X5.27 52,36.27 49.27,36.27 48,35
DIO3
  Top 0.25: U3.17 47.75,35.5
  Top 0.254: X5.28 49.79,37.54 47.75,35.5
DIO4
  Top 0.25: U3.19 46.25,36.5
  Top 0.254: X5.29 52,38.81 48.56,38.81 46.25,36.5
DIO5
  Top 0.25: U3.20 46,37
  Top 0.254: X5.30 49.08,40.08 46,37
DIO6
  Top 0.25: U3.22 46.25,38
  Top 0.254: X5.31 52,41.35 49.6,41.35 46.25,38
DIO7
  Top 0.25: U3.23 46,38.5
  Top 0.254: X5.32 50.12,42.62 46,38.5
DN
  Top 0.25: U1.21 13,30 10.5,27.5 10.5,26.25 9.75,25.5 2.75,25.5 1.94,26.31 1.94,30.57 3.25,31.88 X3.3
DP
  Top 0.25: U1.19 12.5,31 9.76,28.26 5.26,28.26 5.25,28.25 4.5,29 4.5,33.51 3.42,34.59 X3.4
EIO0
  Top 0.25: U4.2 46,48.5
  Top 0.254: X5.33 52,43.89 49.71,43.89 49,44.6 49,45.5 46,48.5
EIO1
  Top 0.25: U4.3 46.25,49
  Top 0.254: X5.34 50.09,45.16 46.25,49
EIO2
  Top 0.25: U4.5 46,50
  Top 0.254: X5.35 52,46.43 49.71,46.43 49.57,46.43 49.5,46.5 49.46,46.54 46,50
EIO3
  Top 0.25: U4.6 46.25,50.5
  Top 0.254: X5.36 49.05,47.7 46.25,50.5
EIO4
  Top 0.25: U4.8 48,51.5
  Top 0.254: X5.37 52,48.97 49.78,48.97 49.03,49.72 49.03,50.47 48,51.5
EIO5
  Top 0.25: U4.9 48.25,52
  Top 0.254: X5.38 50.01,50.24 48.25,52
EIO6
  Top 0.254: X5.39 52,51.51 49.46,51.51 47.97,53 U4.11
EIO7
  Top 0.254: X5.40 48.96,52.78 48.24,53.5 U4.12
FIO0
  Top 0.25: U4.13 48.02,54
  Top 0.254: X5.41 52,54.05 49.46,54.05 arc-90 49.41,54 48.02,54
FIO1
  Top 0.25: U4.14 47.75,54.5
  Top 0.254: X5.42 48.57,55.32 47.75,54.5
FIO2
  Top 0.25: U4.16 48,55.5
  Top 0.254: X5.43 52,56.59 49.09,56.59 48,55.5
FIO3
  Top 0.25: U4.17 47.75,56
  Top 0.254: X5.44 49.61,57.86 47.75,56
FIO4
  Top 0.25: U4.19 46.25,57
  Top 0.254: X5.45 52,59.13 48.38,59.13 46.25,57
FIO5
  Top 0.25: U4.20 46,57.5
  Top 0.254: X5.46 48.9,60.4 46,57.5
FIO6
  Top 0.25: U4.22 46.25,58.5
  Top 0.254: X5.47 52,61.67 49.42,61.67 46.25,58.5
FIO7
  Top 0.25: U4.23 46,59
  Top 0.254: 46,59 49.94,62.94 X5.48
GND  (via drill 0.5)
  Top 0.25: U1.10 16.25,35.5 | U1.11 16.25,35 | U1.93 20.25,40.5 | U1.79 27.25,40.5 | U1.65 29.25,35 | U1.60 29.25,32.5 | U1.46 26.75,27.5 | U1.32 19.75,27.5 | U3.28 39.5,37.5 | U3.21 44,37.5 | U3.39 39.5,32 | U3.45 39.5,29 | U3.15 44,34.5 | U3.10 44,32 | U3.4 44,29 | U4.4 44,49.5 | U4.45 39.5,49.5 | U4.39 39.5,52.5 | U4.28 39.5,58 | U4.21 44,58 | U4.15 44,55 | U4.10 44,52.5 | U4.34 39.5,55 | U2.21 44,17.5 | U2.15 44,14.5 | U2.10 44,12 | U2.4 44,9 | U2.45 39.5,9 | U2.39 39.5,12 | U2.34 39.5,14.5 | U2.28 39.5,17.5 | U3.34 39.5,34.5
  other vias: 38.5,46.5 38.5,21 38.5,26.25 15,42.25 15,44 30.5,26.25 36.75,46.5 31.75,43.25 38.25,60.75
  pour Top (isolate 0.5, no thermals): 0,70 56,70 56,0 0,0
  pour Bottom (isolate 0.5, no thermals): 0,70 56,70 56,0 0,0
IO0
  Top 0.25: U1.1 14,40 13.5,40.5 13.5,47.39 | X4.9 17.71,55.95 16.44,57.23 16.44,58.5 17.71,59.77 20.25,59.77 22.79,62.3 R9.1
  Top 0.254: X4.9 17.71,54.05 13.5,49.84 13.5,47.39
IO1
  Top 0.25: U1.2 13.75,39.5 13,40.25 13,47.66 | 16.44,54.05 16.44,55.95 15.17,57.23 X4.8 15.17,58.5 17.08,60.4 18.34,60.4 20.25,62.3 R8.1
  Top 0.254: 16.44,54.05 13,50.61 13,47.66
IO2
  Top 0.25: U1.3 13.5,39 12.5,40 12.5,47.92 | X4.7 15.17,55.95 13.9,57.23 13.9,58.5 17.71,62.3 R7.1
  Top 0.254: X4.7 15.17,54.05 12.5,51.38 12.5,47.92
IO3
  Top 0.25: U1.4 13.25,38.5 12,39.75 12,48.2 | R6.1 15.17,62.3 12.63,59.77 X4.6 12.63,57.23 13.9,55.95 13.9,54.05
  Top 0.254: 13.9,54.05 12,52.15 12,48.2
IO4
  Top 0.25: U1.5 13,38 11.5,39.5 11.5,48.47 | X4.5 12.63,55.95 11.36,57.23 11.36,61.03 12.63,62.3 R5.1
  Top 0.254: X4.5 12.63,54.05 11.5,52.92 11.5,48.47
IO5
  Top 0.25: U1.6 12.75,37.5 11,39.25 11,48.78 | R4.1 X4.4 10.09,57.23 11.36,55.95
  Top 0.254: 11.36,55.95 11.36,54.05 11,53.69 11,48.78
IO6
  Top 0.25: U1.7 12.5,37 10.5,39 10.5,49.01 | R3.1 7.55,62.3 8.82,61.03 8.82,57.23 10.09,55.95 X4.3
  Top 0.254: X4.3 10.09,54.05 10.5,53.64 10.5,49.01
IO7
  Top 0.25: U1.8 12.25,36.5 10,38.75 10,49.24 | R2.1 5.01,60.4 X4.2 7.55,57.23 8.82,55.95 8.82,55.84
  Top 0.254: 8.82,55.84 8.82,54.05 10,52.87 10,49.24
IO8
  Top 0.25: U1.12 12.75,34.5 12,35.25 12,36 9.5,38.5 9.5,49.47
  Top 0.254: X4.1 7.55,54.05 9.5,52.1 9.5,49.47
IO9
  Top 0.25: U2.1 41,7.5 39.5,6 35.75,6 35.25,6.5 30.75,6.5 16.25,21 16.25,24.5 16.75,25 U1.26
IO10  (via drill 0.5)
  Top 0.25: U2.48 37,7.5 v36.5,7 31,7 16.75,21.25 16.75,24.25 17.25,24.75 U1.27
  Bottom 1.016: R13.1 v36.5,7
IO11
  Top 0.25: U1.28 17.75,24.5 17.25,24 17.25,21.5 30.75,8 U2.47
IO12
  Top 0.25: U1.29 18.25,24.25 17.75,23.75 17.75,21.75 31,8.5 U2.46
IO13
  Top 0.25: U1.30 18.75,24 18.25,23.5 18.25,22 30.75,9.5 U2.44
IO14
  Top 0.25: U1.33 20.25,20.75 31,10 U2.43
IO15
  Top 0.25: U1.34 20.75,21 29.75,12 35.75,12 36.75,11 U2.41
IO16
  Top 0.25: U1.35 21.25,21.25 30,12.5 36,12.5 37,11.5 U2.40
IO17
  Top 0.25: U1.36 21.75,21.5 30.25,13 36.25,13 36.75,12.5 U2.38
IO18
  Top 0.25: U1.37 22.25,21.75 30.5,13.5 36.5,13.5 37,13 U2.37
IO19
  Top 0.25: U1.38 22.75,22 30.75,14 36.75,14 37.25,13.5 U2.36
IO20
  Top 0.25: U1.39 23.25,22.25 31,14.5 37,14.5 37.5,14 U2.35
IO21
  Top 0.25: U1.40 23.75,22.5 31.25,15 U2.33
IO22
  Top 0.25: U1.41 24.25,22.75 31.5,15.5 U2.32
IO23
  Top 0.25: U1.42 24.75,23 30.25,17.5 36,17.5 37,16.5 U2.30
IO24
  Top 0.25: U1.43 25.25,23.25 30.5,18 36.25,18 37.25,17 U2.29
IO25
  Top 0.25: U1.44 25.75,23.5 30.75,18.5 36.5,18.5 37,18 U2.27
IO26
  Top 0.25: U1.47 27.25,24.5 32.75,19 36.75,19 37.25,18.5 U2.26
IO27  (via drill 0.5)
  Top 0.25: U1.48 27.75,24.75 31.5,21 v32.25,21 33.75,19.5 37,19.5 37.5,19 U2.25
  Bottom 1.27: R14.1 v32.25,21
IO28
  Top 0.25: U1.49 28.25,25 28.75,24.5 37.75,24.5 43.25,19 U2.24
IO29
  Top 0.25: U1.50 28.75,25.25 29,25 41.75,25 44.25,27.5 U3.1
IO30  (via drill 0.5)
  Top 0.25: U1.51 31.75,28 v32.25,27.5 U3.48
  Bottom 1.27: R15.1 v32.25,27.5
IO31
  Top 0.25: U1.52 35,28.5 35.5,28 U3.47
IO32
  Top 0.25: U1.53 35.25,29 35.75,28.5 U3.46
IO33
  Top 0.25: U1.54 35.5,29.5 36,29 37,29 37.5,29.5 U3.44
IO34
  Top 0.25: U1.55 35.75,30 36.25,29.5 36.75,29.5 37.25,30 U3.43
IO35
  Top 0.25: U1.56 35.25,30.5 36.25,31.5 36.75,31.5 37.25,31 U3.41
IO36
  Top 0.25: U1.57 35,31 36,32 37,32 37.5,31.5 U3.40
IO37
  Top 0.25: U1.58 34.75,31.5 35.75,32.5 U3.38
IO38
  Top 0.25: U3.37 35.25,33 34.75,33.5 34.25,33.5 33.25,32.5 32.25,32.5 31.75,33 U1.61
IO39
  Top 0.25: U3.36 35.5,33.5 35,34 34,34 33,33 32.5,33 32,33.5 U1.62
IO40
  Top 0.25: U1.64 32,34.5 32.5,35 34.75,35 35.75,34 U3.35
IO41
  Top 0.25: U1.66 35,35.5 36,34.5 37,34.5 37.5,35 U3.33
IO42
  Top 0.25: U3.32 37.25,35.5 36.75,35 36.25,35 35.25,36 U1.67
IO43
  Top 0.25: U1.68 35.5,36.5 36,37 36.75,37 37.25,36.5 U3.30
IO44
  Top 0.25: U3.29 37.5,37 37,37.5 35.75,37.5 35.25,37 U1.69
IO45
  Top 0.25: U1.70 35,37.5 35.5,38 U3.27
IO46
  Top 0.25: U1.71 34.75,38 35.25,38.5 U3.26
IO47  (via drill 0.5)
  Top 0.25: U1.72 34.5,38.5 35.5,39.5 v36.5,39.5 37,39.5 37.5,39 U3.25
  Bottom 1.27: R16.1 v36.5,39.5
IO48
  Top 0.25: U1.73 34.25,39 35.75,40.5 42.75,40.5 44.25,39 U3.24
IO49
  Top 0.25: U1.74 34,39.5 42.5,48 U4.1
IO50  (via drill 0.5)
  Top 0.25: U4.48 34.75,48 33.5,46.75 v33.5,46 33.5,41.75 31.75,40 U1.75
  Bottom 1.27: R17.1 v33.5,46
IO51
  Top 0.25: U1.76 28.75,42.75 34.5,48.5 U4.47
IO52
  Top 0.25: U1.77 28.25,43 34.25,49 U4.46
IO53
  Top 0.25: U1.78 27.75,43.25 34,49.5 37,49.5 37.5,50 U4.44
IO54
  Top 0.25: U1.81 26.25,44.25 32,50 36.75,50 37.25,50.5 U4.43
IO55
  Top 0.25: U1.82 25.75,44.5 33.25,52 36.75,52 37.25,51.5 U4.41
IO56
  Top 0.25: U1.83 25.25,44.75 33,52.5 37,52.5 37.5,52 U4.40
IO57
  Top 0.25: U1.84 24.75,45 32.75,53 U4.38
IO58
  Top 0.25: U4.37 32.5,53.5 24.25,45.25 U1.85
IO59
  Top 0.25: U4.36 32.25,54 23.75,45.5 U1.86
IO60
  Top 0.25: U4.35 32,54.5 23.25,45.75 U1.87
IO61
  Top 0.25: U1.88 22.75,46 31.75,55 36.75,55 37.25,55.5 U4.33
IO62
  Top 0.25: U1.89 22.25,46.25 31.5,55.5 36.5,55.5 37,56 U4.32
IO63
  Top 0.25: U1.90 21.75,46.5 32.75,57.5 36.75,57.5 37.25,57 U4.30
IO64
  Top 0.25: U1.91 21.25,46.75 32.5,58 37,58 37.5,57.5 U4.29
IO65
  Top 0.25: U1.92 20.75,47 32.25,58.5 U4.27
IO66
  Top 0.25: U1.95 19.25,44.25 18.75,44.75 18.75,45.75 32,59 U4.26
IO67  (via drill 0.5)
  Top 0.25: U1.96 18.75,44 18.25,44.5 18.25,46 32.25,60 v34.5,60 35,59.5 U4.25
  Bottom 1.27: R18.1 34.7,60.2 v34.5,60
IO68
  Top 0.25: U1.97 18.25,43.75 17.75,44.25 17.75,46.25 33.5,62 41.5,62 44,59.5 U4.24
IO69
  Top 0.25: U1.98 17.75,43.25 17.25,43.75 17.25,46.58
  Top 0.254: X4.12 21.52,56.59 21.52,54.05 17.25,49.78 17.25,46.58
IO70
  Top 0.25: U1.99 17.25,43 16.75,43.5 16.75,46.85
  Top 0.254: X4.11 20.25,54.05 16.75,50.55 16.75,46.85
IO71
  Top 0.25: U1.100 16.75,42.75 16.25,43.25 16.25,46.5 16.25,47.12
  Top 0.254: X4.10 18.98,56.59 18.98,54.05 16.25,51.32 16.25,46.5
N$1
  Top 1.27: LED1.A R2.2
N$2
  Top 1.27: LED2.A R3.2
N$3
  Top 1.27: LED3.A R4.2
N$4
  Top 1.27: LED4.A R5.2
N$5
  Top 1.27: LED5.A R6.2
N$6
  Top 1.27: LED6.A R7.2
N$7
  Top 1.27: LED7.A R8.2
N$8
  Top 1.27: LED8.A R9.2
N$12
  Top 1.016: R1.2 30.35,2.2 LED9.A
TCK
  Top 0.25: U1.24 13.75,28.5 13.25,28 13.25,16.25
  Top 0.254: 13.25,16.25 16.44,13.06 16.44,11.64 17.21,10.87 19,10.87 20.25,12.12 X1.1
  Bottom 1.27: R12.2 20.5,11.76 X1.1
TDI
  Top 0.25: U1.23 13.5,29 12.75,28.25 12.75,16.27
  Top 0.254: 12.75,16.27 12.75,15 10.09,12.34 X1.9
  Bottom 1.27: R11.1 10.25,11.67 X1.9
TDO
  Top 0.25: U1.25 14,28 13.75,27.75 13.75,17
  Top 0.254: X1.3 17.71,13.04 13.75,17
TMS
  Top 0.25: U1.22 13.25,29.5 12.25,28.5 12.25,16.25
  Top 0.254: X1.5 13.9,10.87 9.34,10.87 8.82,11.39 8.82,12.82 12.25,16.25
  Bottom 1.27: R10.1 15.25,11.67 X1.5
VCC  (via drill 0.5)
  Top 0.25: U2.7 47,10.5 v47.5,10 | U2.18 47,16 v47.5,16.5 | U3.7 47,30.5 v47.5,30 | U3.18 47,36 v47.5,36.5 | U4.7 47,51 v47.5,50.5 | v47.5,57 47,56.5 U4.18 46.25,56.5
  Top 1.016: JP1.2 28,4.5 28.25,4.25 30.2,4.25 R1.1
  Bottom 1.27: C16.1 v47.5,57 | C17.1 v47.5,50.5 | C18.1 v47.5,36.5 | C19.1 v47.5,30 | C20.1 v47.5,16.5 | C21.1 v47.5,10 | C15.1 47.5,65.5
  Bottom 1.676: X5.50 50.61,65.5 47.5,65.5 v47.5,57 v47.5,50.5 v47.5,36.5 v47.5,30 v47.5,16.5 v47.5,10 42,4.5 JP1.2

### Text on the board
Bottom: uBus Adapter rev.B By MVV